# EAGLE design oled-control-panel (EAGLE 7.7.0)
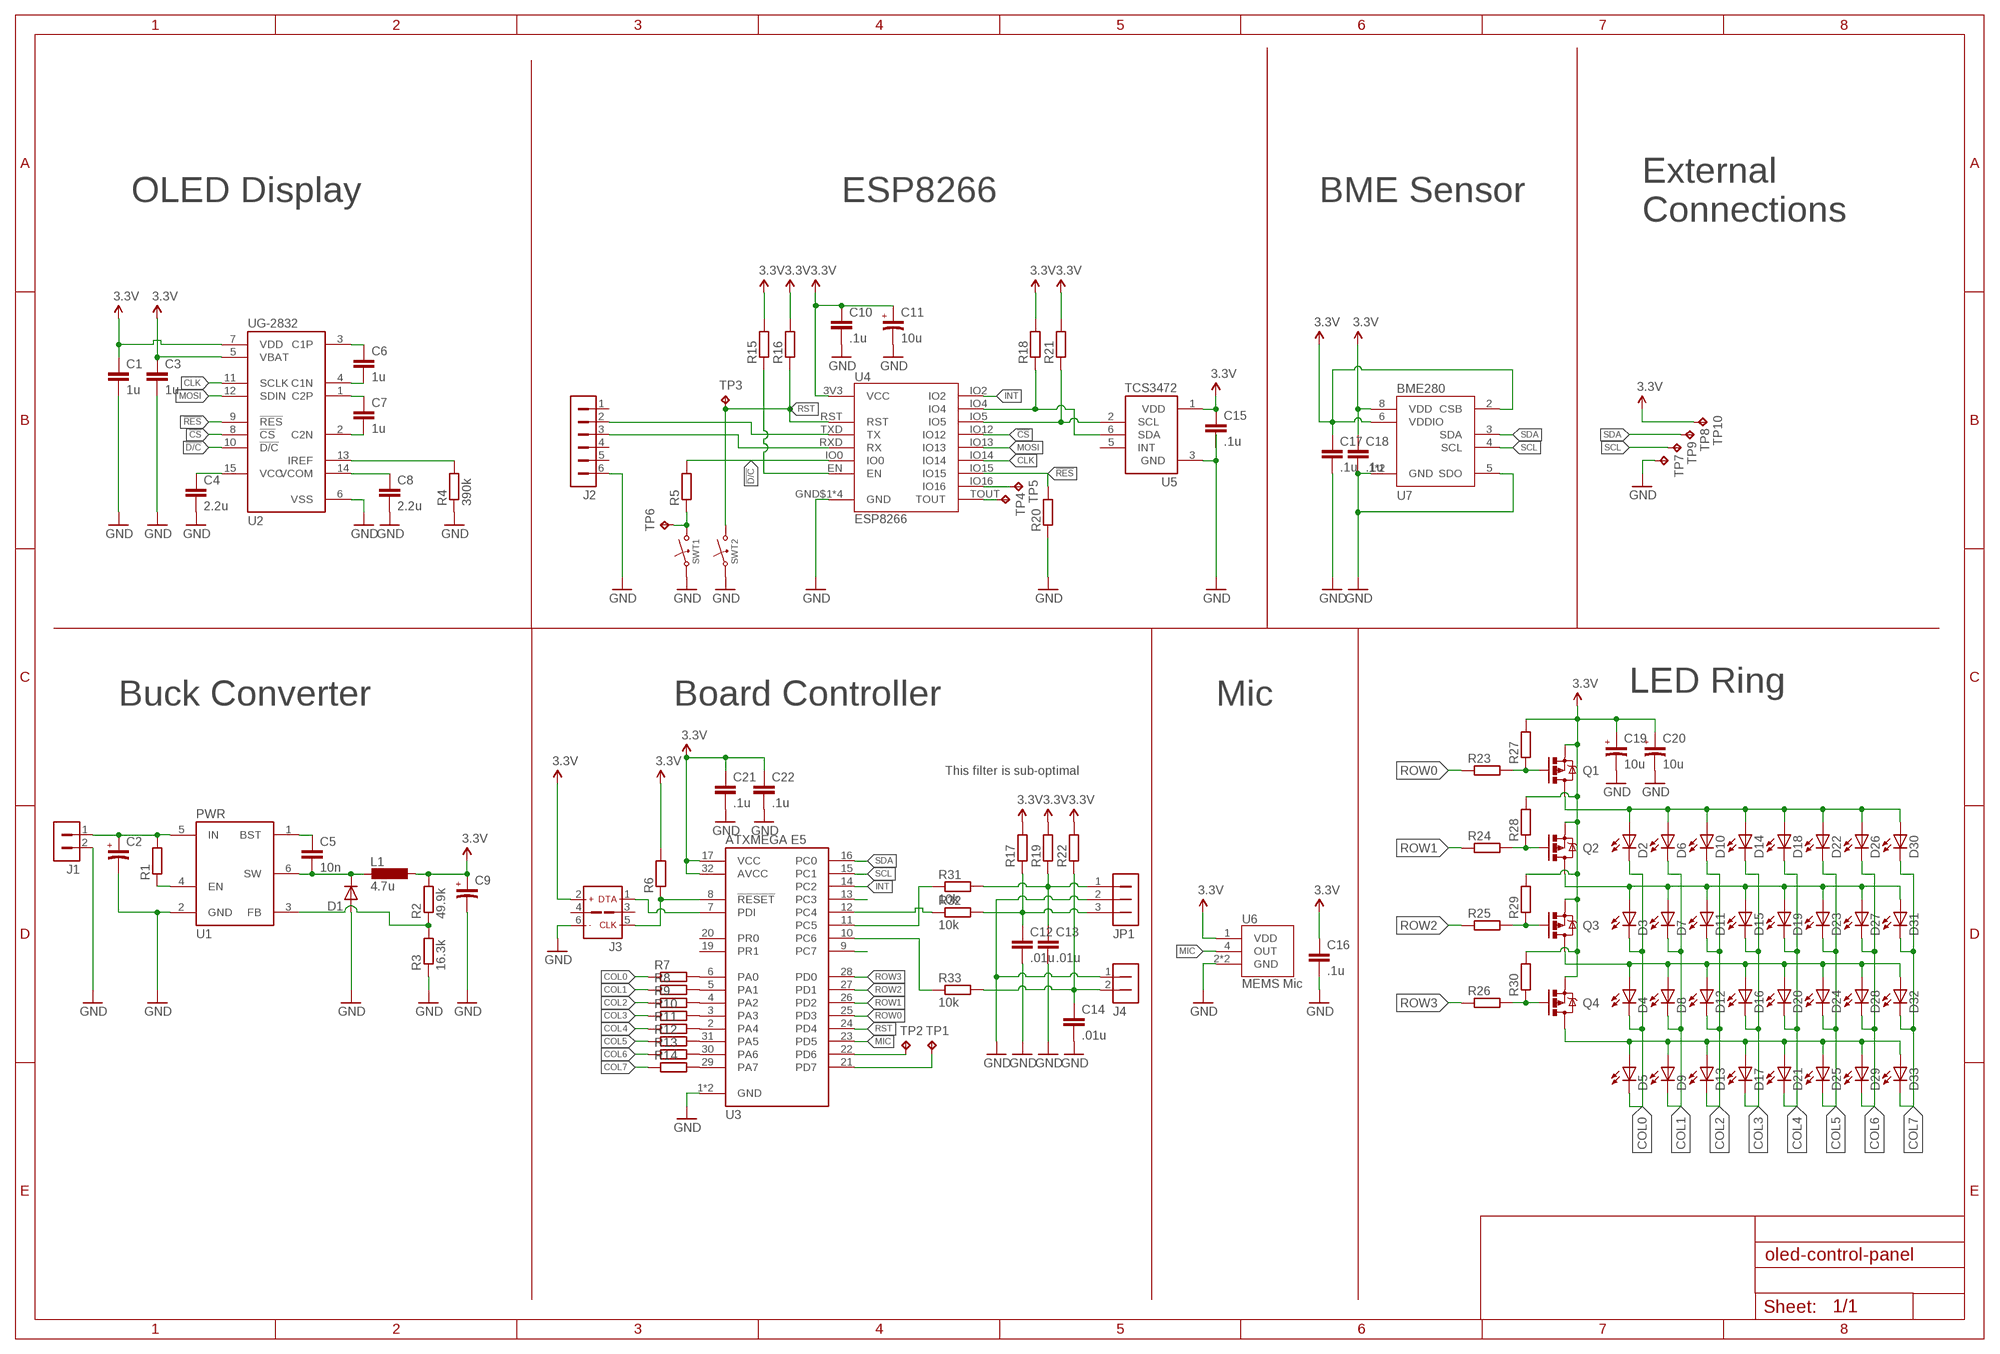
[diagram p0: schematic, sheet 1]

## Parts
C1  1u  C_0805  [0805]
C2  C_POL_1206  [1206_POL]
C3  1u  C_0805  [0805]
C4  2.2u  C_0805  [0805]
C5  10n  C_0805  [0805]
C6  1u  C_0805  [0805]
C7  1u  C_0805  [0805]
C8  2.2u  C_0805  [0805]
C9  C_POL_1206  [1206_POL]
C10  .1u  C_0603  [0603]
C11  10u  C_POL_1206  [1206_POL]
C12  .01u  C_0805  [0805]
C13  .01u  C_0805  [0805]
C14  .01u  C_0805  [0805]
C15  .1u  C_0603  [0603]
C16  .1u  C_0603  [0603]
C17  .1u  C_0603  [0603]
C18  .1u  C_0603  [0603]
C19  10u  C_POL_1206  [1206_POL]
C20  10u  C_POL_1206  [1206_POL]
C21  .1u  C_0603  [0603]
C22  .1u  C_0603  [0603]
D1  D_FM581X  [DO-214AC]
D2  LED_0805  [0805_LED]
D3  LED_0805  [0805_LED]
D4  LED_0805  [0805_LED]
D5  LED_0805  [0805_LED]
D6  LED_0805  [0805_LED]
D7  LED_0805  [0805_LED]
D8  LED_0805  [0805_LED]
D9  LED_0805  [0805_LED]
D10  LED_0805  [0805_LED]
D11  LED_0805  [0805_LED]
D12  LED_0805  [0805_LED]
D13  LED_0805  [0805_LED]
D14  LED_0805  [0805_LED]
D15  LED_0805  [0805_LED]
D16  LED_0805  [0805_LED]
D17  LED_0805  [0805_LED]
D18  LED_0805  [0805_LED]
D19  LED_0805  [0805_LED]
D20  LED_0805  [0805_LED]
D21  LED_0805  [0805_LED]
D22  LED_0805  [0805_LED]
D23  LED_0805  [0805_LED]
D24  LED_0805  [0805_LED]
D25  LED_0805  [0805_LED]
D26  LED_0805  [0805_LED]
D27  LED_0805  [0805_LED]
D28  LED_0805  [0805_LED]
D29  LED_0805  [0805_LED]
D30  LED_0805  [0805_LED]
D31  LED_0805  [0805_LED]
D32  LED_0805  [0805_LED]
D33  LED_0805  [0805_LED]
J1  1X2_MOLEX_53254  [1X2_MOLEX_53254]
J2  1X6_SMD_RIGHT  [1X6_SMD_RIGHT]
J3  PDI_SMD  [ISP_SMD]
J4  1X2_MOLEX_53254  [1X2_MOLEX_53254]
JP1  1X3_MOLEX_53254  [1X3_MOLEX_53254]
L1  4.7u  L_1210  [1210]
Q1  PMV160UP  [SOT23]
Q2  PMV160UP  [SOT23]
Q3  PMV160UP  [SOT23]
Q4  PMV160UP  [SOT23]
R1  R_0805  [0805]
R2  49.9k  R_0805  [0805]
R3  16.3k  R_0805  [0805]
R4  390k  R_0805  [0805]
R5  R_0603  [0603]
R6  R_0603  [0603]
R7  R_0603  [0603]
R8  R_0603  [0603]
R9  R_0603  [0603]
R10  R_0603  [0603]
R11  R_0603  [0603]
R12  R_0603  [0603]
R13  R_0603  [0603]
R14  R_0603  [0603]
R15  R_0603  [0603]
R16  R_0603  [0603]
R17  R_0603  [0603]
R18  R_0603  [0603]
R19  R_0603  [0603]
R20  R_0603  [0603]
R21  R_0603  [0603]
R22  R_0603  [0603]
R23  R_0603  [0603]
R24  R_0603  [0603]
R25  R_0603  [0603]
R26  R_0603  [0603]
R27  R_0603  [0603]
R28  R_0603  [0603]
R29  R_0603  [0603]
R30  R_0603  [0603]
R31  10k  R_0603  [0603]
R32  10k  R_0603  [0603]
R33  10k  R_0603  [0603]
SWT1  BUTTON_SMD_2P  [BTN_SMD_2PIN]
SWT2  BUTTON_SMD_2P  [BTN_SMD_2PIN]
TP1  TPTP15R  [TP15R]
TP2  TPTP15R  [TP15R]
TP3  TPTP15R  [TP15R]
TP4  TPTP15R  [TP15R]
TP5  TPTP15R  [TP15R]
TP6  TPTP15R  [TP15R]
TP7  TPTP15R  [TP15R]
TP8  TPTP15R  [TP15R]
TP9  TPTP15R  [TP15R]
TP10  TPTP15R  [TP15R]
U1  AP3211  [SOT23-6]
U2  UG-2832HSWEG04  [UG-2832HSWEG04]
U3  ATXMEGA_E5_TQFP  [TQFP32]
U4  ESP8266_13  [ESP13]
U5  TCS3472  [TCS3472]
U6  SPW2430HR5H_B  [SPW2430HR5H_B]
U7  BME280  [BME280]

## Nets
3.3V: C1.1 C3.1 C9.1 C10.1 C11.1 C15.1 C16.1 C17.1 C18.1 C19.1 C20.1 C21.1 C22.1 J3.2(VCC) L1.2 Q1.2(S) Q2.2(S) Q3.2(S) Q4.2(S) R2.2 R6.2 R15.2 R16.2 R17.2 R18.2 R19.2 R21.2 R22.2 R27.2 R28.2 R29.2 R30.2 TP10.TP U2.5(VBAT) U2.7(VDD) U3.17(VCC) U3.32(AVCC) U4.3V3(VCC) U5.1(VDD) U6.1(VDD) U7.2(CSB) U7.6(VDDIO) U7.8(VDD)
!CS: U2.8(!CS) U4.IO12
!D/C: R5.2 U2.10(!D/C) U4.IO0
!RES: R20.2 U2.9(!RES) U4.IO15
A: C12.1 JP1.3 R17.1 R32.2
B: R31.1 U3.11(PC5)
BTN: C14.1 J4.2 R22.1 R33.2
CLK: U2.11(SCLK) U4.IO14
COL0: D2.C D3.C D4.C D5.C R7.1
COL1: D6.C D7.C D8.C D9.C R8.1
COL2: D10.C D11.C D12.C D13.C R9.1
COL3: D14.C D15.C D16.C D17.C R10.1
COL4: D18.C D19.C D20.C D21.C R11.1
COL5: D22.C D23.C D24.C D25.C R12.1
COL6: D26.C D27.C D28.C D29.C R13.1
COL7: D30.C D31.C D32.C D33.C R14.1
GND: C1.2 C2.2 C3.2 C4.2 C8.2 C9.2 C10.2 C11.2 C12.2 C13.2 C14.2 C15.2 C16.2 C17.2 C18.2 C19.2 C20.2 C21.2 C22.2 D1.A J1.2 J2.6 J3.6(GND) J4.1 JP1.2 R3.1 R4.1 R20.1 SWT1.1 SWT2.1 TP7.TP U1.2(GND) U2.6(VSS) U3.1(GND) U3.18(GND) U4.GND$1(GND) U4.GND$2(GND) U4.GND$3(GND) U4.GND$4(GND) U5.3(GND) U6.2(GND) U6.3(GND) U7.1(GND) U7.5(SDO) U7.7(GND)
INT: U3.14(PC2) U4.IO2
MIC: U3.23(PD5) U6.4(OUT)
MOSI: U2.12(SDIN) U4.IO13
N$1: C6.1 U2.3(C1P)
N$2: C6.2 U2.4(C1N)
N$3: C7.1 U2.1(C2P)
N$4: C7.2 U2.2(C2N)
N$5: R4.2 U2.13(IREF)
N$6: C8.1 U2.14(VCOM)
N$7: C2.1 J1.1 R1.2 U1.5(IN)
N$8: C5.1 U1.1(BST)
N$9: C4.1 U2.15(VCC)
N$10: C5.2 D1.C L1.1 U1.6(SW)
N$11: R2.1 R3.2 U1.3(FB)
N$13: R1.1 U1.4(EN)
N$14: J3.5(CLK) R6.1 U3.8(!RESET)
N$15: Q1.1(G) R23.2 R27.1
N$16: Q2.1(G) R24.2 R28.1
N$17: Q3.1(G) R25.2 R29.1
N$18: Q4.1(G) R26.2 R30.1
N$19: J3.1(DATA) U3.7(PDI)
N$20: R7.2 U3.6(PA0)
N$21: R8.2 U3.5(PA1)
N$22: D3.A D7.A D11.A D15.A D19.A D23.A D27.A D31.A Q2.3(D)
N$23: D4.A D8.A D12.A D16.A D20.A D24.A D28.A D32.A Q3.3(D)
N$24: D5.A D9.A D13.A D17.A D21.A D25.A D29.A D33.A Q4.3(D)
N$25: D2.A D6.A D10.A D14.A D18.A D22.A D26.A D30.A Q1.3(D)
N$26: R9.2 U3.4(PA2)
N$27: R10.2 U3.3(PA3)
N$28: R11.2 U3.2(PA4)
N$29: R12.2 U3.31(PA5)
N$30: R13.2 U3.30(PA6)
N$31: R14.2 U3.29(PA7)
N$32: R5.1 SWT1.2 TP6.TP
N$33: TP5.TP U4.IO16
N$35: J2.2 U4.TXD(TX)
N$36: J2.3 U4.RXD(RX)
N$38: R15.1 U4.EN
N$41: R32.1 U3.12(PC4)
N$42: R33.1 U3.10(PC6)
N$43: U3.13(PC3)
N$44: C13.1 JP1.1 R19.1 R31.2
N$45: TP4.TP U4.TOUT
N$46: U3.9(PC7)
N$48: TP2.TP U3.22(PD6)
N$49: TP1.TP U3.21(PD7)
ROW0: R23.1 U3.25(PD3)
ROW1: R24.1 U3.26(PD2)
ROW2: R25.1 U3.27(PD1)
ROW3: R26.1 U3.28(PD0)
RST: R16.1 SWT2.2 TP3.TP U3.24(PD4) U4.RST
SCL: R21.1 TP9.TP U3.15(PC1) U4.IO5 U5.2(SCL) U7.4(SCL)
SDA: R18.1 TP8.TP U3.16(PC0) U4.IO4 U5.6(SDA) U7.3(SDA)
Unconnected: J2.1 J2.4 J2.5 J3.3 J3.4 U3.19(PR1) U3.20(PR0) U5.5(INT)

## Notes on the sheet
- OLED Display | ESP8266 | BME Sensor
- External
  Connections
- LED Ring
- Buck Converter | Board Controller | Mic
- This filter is sub-optimal

## Library data of the parts
C1 C3-C8 C10 C12-C18 C21 C22 = Sebastian:C
C2 C9 C11 C19 C20 = Sebastian:C_POL
D1 = Sebastian:D
D2-D33 = Sebastian:LED
J1 J4 = Sebastian:1X2
J2 = Sebastian:1X6
J3 = Sebastian:PDI
JP1 = Sebastian:1X3
L1 = Sebastian:L
Q1-Q4 = Sebastian:PMV160UP: 20 V, 1.2 A P-channel Trench MOSFET - Datasheet <http://www.nxp.com/documents/data_sheet/PMV160UP.pdf>
R1-R33 = Sebastian:R
SWT1 SWT2 = Sebastian:BUTTON
TP1-TP10 = testpad:TP: Test pad
U1 = Sebastian:AP3211
U2 = Sebastian:UG-2832HSWEG04: OLED Display Datasheet <http://www.adafruit.com/datasheets/UG-2832HSWEG04.pdf>
U3 = Sebastian:ATXMEGA_E5: ATXMEGA E5 Dataheet <http://www.atmel.com/Images/Atmel-8153-8-and-16-bit-AVR-Microcontroller-XMEGA-E-ATxmega8E5-ATxmega16E5-ATxmega32E5_Datasheet.pdf>
U4 = Sebastian:ESP8266
U5 = Sebastian:TCS3472: Color Light to Digital Converter with IR-filter Datasheet <http://www.mouser.com/ds/2/588/TCS3472_Datasheet_EN_v1-255426.pdf>
U6 = Sebastian:SPW2430HR5H_B
U7 = Sebastian:BME280

## Board
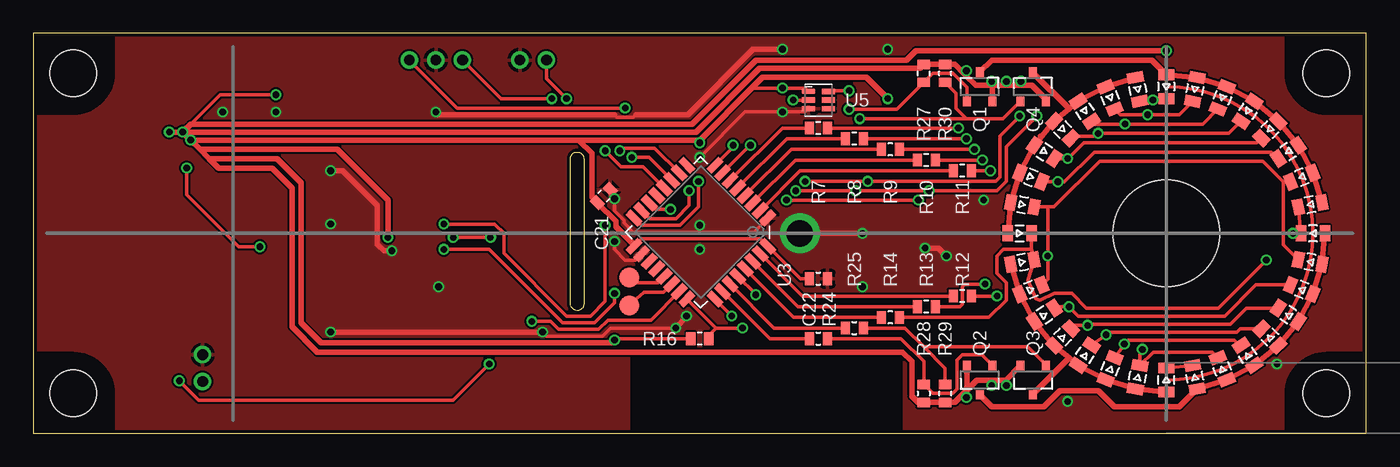
[diagram p1: board, top side]
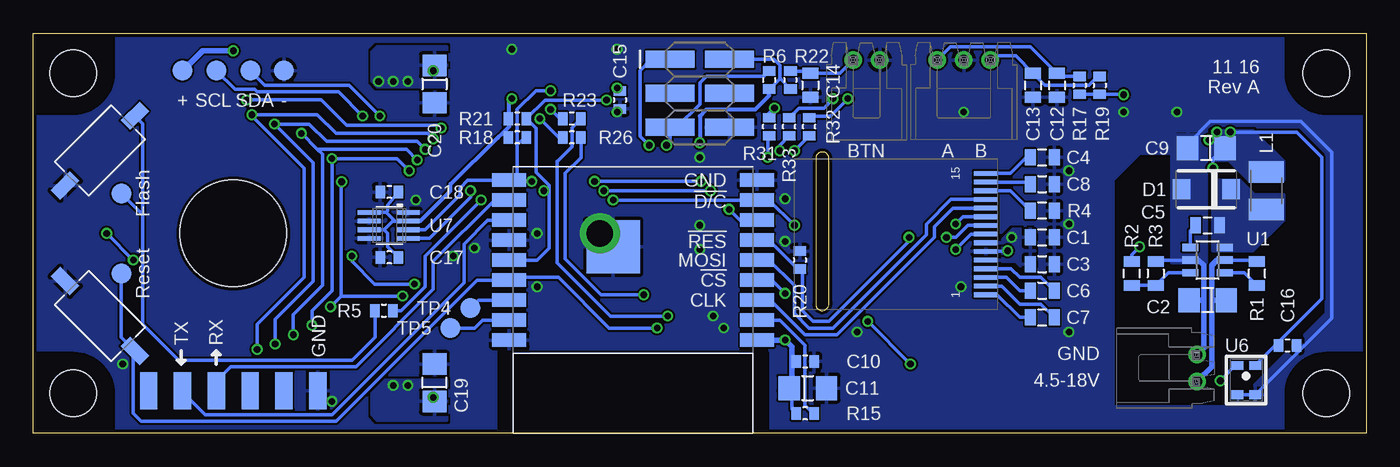
[diagram p2: board, bottom side, seen from below]

Size 100 x 30 mm. Coordinates in mm from the lower left corner, seen from the top.
Outline: 0,0 100,0 100,30 0,30 0,0
Outline: 40.3,9.8 40.3,20.6 arc-90 40.8,21.1 arc-90 41.3,20.6 41.3,9.7 arc-90 40.8,9.2 arc-90 40.3,9.8
Copper layers (1*16): Top 0.035mm / dielectric 1.5mm / Bottom 0.035mm
Design rules "SeeedStudio_2layer_DRU_no_angle_20140221": minimum track width 6mil, minimum drill 12mil, track to track 6mil, track to pad 6mil, pad to pad 6mil, via to via 6mil, smd to smd 0mil, copper to edge 10mil, drill to drill 10mil, minimum pad ring 10mil, minimum via ring 6mil, stop-mask expansion 2mil, vias tented up to drill 100mil, thermal gap 10mil
Holes 8 mm at 85,15
Holes 3.5 mm at 3,27 3,3 97,27 97,3
tKeepout: area 9.3,9.2 to 40.9,20.7; area 94,24 to 100,30; area 94,0 to 100,6; area 0,24 to 6,30; area 0,0 to 6,6
bKeepout: area 79,8.5 to 91,21.5; area 94,24 to 100,30; area 94,0 to 100,6; area 0,24 to 6,30; area 0,0 to 6,6

### Footprints (pad centres in the part's own frame; a part is rotated, then mirrored left to right if it is on the bottom)
0805 = smd 0.8 x 1.2: 1 -0.9,0; 2 0.9,0
1206_POL = smd 1.6 x 1.8: 1 -1.4,0; 2 1.4,0
0603 = smd 0.7 x 0.95: 1 -0.675,0; 2 0.675,0
DO-214AC = smd 1.32 x 1.52: A 1.85,0; C -1.85,0
0805_LED = smd 0.8 x 1.2: A -0.9,0; C 0.9,0
1X2_MOLEX_53254 = drill 0.8: 1 -1,0; 2 1,0
1X6_SMD_RIGHT = smd 1.3 x 2.8: 1 -6.35,0; 2 -3.81,0; 3 -1.27,0; 4 1.27,0; 5 3.81,0; 6 6.35,0
ISP_SMD = smd 1.27 x 3.68: 1 -2.54,-2.22; 2 -2.54,2.22; 3 0,-2.22; 4 0,2.22; 5 2.54,-2.22; 6 2.54,2.22
1X3_MOLEX_53254 = drill 0.8: 1 -2,0; 2 0,0; 3 2,0
1210 = smd 1.6 x 2.6: 1 -1.4,0; 2 1.4,0
SOT23 = smd 0.6 x 0.7: 1 -0.95,-1.1; 2 0.95,-1.1; 3 0,1.1
BTN_SMD_2PIN = smd 2 x 1: 1 -3.7,0; 2 3.7,0
TP15R = smd 1.5 x 1.5: TP 0,0
SOT23-6 = smd 0.55 x 1.2: 1 -0.95,-1.3; 2 0,-1.3; 3 0.95,-1.3; 4 0.95,1.3; 5 0,1.3; 6 -0.95,1.3
UG-2832HSWEG04 = smd 0.35 x 1.8: 1 4.55,0; 2 3.9,0; 3 3.25,0; 4 2.6,0; 5 1.95,0; 6 1.3,0; 7 0.65,0; 8 0,0; 9 -0.65,0; 10 -1.3,0; 11 -1.95,0; 12 -2.6,0; 13 -3.25,0; 14 -3.9,0; 15 -4.55,0
TQFP32 = smd 1.27 x 0.559: 1 -4.42,2.8; 2 -4.42,2; 3 -4.42,1.2; 4 -4.42,0.4; 5 -4.42,-0.4; 6 -4.42,-1.2; 7 -4.42,-2; 8 -4.42,-2.8; 17 4.166,-2.8; 18 4.166,-2; 19 4.166,-1.2; 20 4.166,-0.4; 21 4.166,0.4; 22 4.166,1.2; 23 4.166,2; 24 4.166,2.8 | smd 0.559 x 1.27: 9 -2.927,-4.293; 10 -2.127,-4.293; 11 -1.327,-4.293; 12 -0.527,-4.293; 13 0.273,-4.293; 14 1.073,-4.293; 15 1.873,-4.293; 16 2.673,-4.293; 25 2.673,4.293; 26 1.873,4.293; 27 1.073,4.293; 28 0.273,4.293; 29 -0.527,4.293; 30 -1.327,4.293; 31 -2.127,4.293; 32 -2.927,4.293
ESP13 = smd 2.54 x 1: 3V3 -9.3,3; EN -9.3,1.5; GND$1 9.3,-4.5; GND$2 9.3,3; GND$3 -9.3,-9; IO0 -9.3,-7.5; IO2 -9.3,-6; IO4 9.3,-9; IO5 9.3,-3; IO12 -9.3,-1.5; IO13 -9.3,-3; IO14 -9.3,0; IO15 -9.3,-4.5; IO16 9.3,1.5; RST 9.3,-1.5; RXD 9.3,-7.5; TOUT 9.3,0; TXD 9.3,-6 | smd 4 x 4: GND$4 1.5,-4
TCS3472 = smd 1 x 0.4: 1 -0.75,0.65; 2 -0.75,0; 3 -0.75,-0.65; 4 0.75,-0.65; 5 0.75,0; 6 0.75,0.65
SPW2430HR5H_B = smd 0.9 x 0.66: 1 0.675,1.095; 2 0.675,-1.095; 3 -0.675,-1.095; 4 -0.675,1.095
BME280 = smd 1.725 x 0.35: 1 1.4,0.975; 2 1.4,0.325; 3 1.4,-0.325; 4 1.4,-0.975; 5 -1.5,-0.975; 6 -1.5,-0.325; 7 -1.5,0.325; 8 -1.5,0.975

### Placement (x,y rotation side)
C1  24.3,14.7 0 bottom
C2  11.9,10 180 bottom
C3  24.3,12.7 0 bottom
C4  24.3,20.7 0 bottom
C5  11.9,15.6 0 bottom
C6  24.3,10.7 0 bottom
C7  24.3,8.7 0 bottom
C8  24.3,18.7 0 bottom
C9  12,21.4 180 bottom
C10  42.1,5.4 0 bottom
C11  41.9,3.4 0 bottom
C12  23.2,26.1 270 bottom
C13  25,26.1 270 bottom
C14  41.7,26.1 270 bottom
C15  56,25 270 bottom
C16  5.9,6.6 0 bottom
C17  73.3,13.2 180 bottom
C18  73.3,18.1 180 bottom
C19  69.9,3.8 90 bottom
C20  69.9,26.2 270 bottom
C21  42.8,17.8 45 top
C22  58.9,11.6 0 top
D1  12,18.3 180 bottom
D2  85,26 270 top
D3  87.15,4.21 101 top
D4  85,4 90 top
D5  82.85,25.79 281 top
D6  87.15,25.79 259 top
D7  89.21,4.84 112 top
D8  82.85,4.21 79 top
D9  80.79,25.16 292 top
D10  89.21,25.16 248 top
D11  91.11,5.85 124 top
D12  80.79,4.84 68 top
D13  78.89,24.15 304 top
D14  91.11,24.15 236 top
D15  92.78,7.22 135 top
D16  78.89,5.85 56 top
D17  77.22,22.78 315 top
D18  92.78,22.78 225 top
D19  94.15,8.89 146 top
D20  77.22,7.22 45 top
D21  75.85,21.11 326 top
D22  94.15,21.11 214 top
D23  95.16,10.79 158 top
D24  75.85,8.89 34 top
D25  74.84,19.21 338 top
D26  95.16,19.21 202 top
D27  95.79,12.85 169 top
D28  74.84,10.79 23 top
D29  74.21,17.15 349 top
D30  95.79,17.15 191 top
D31  96,15 180 top
D32  74.21,12.85 11 top
D33  74,15 0 top
J1  12.7,4.9 90 bottom
J2  85,3.2 0 bottom
J3  50,25.5 270 bottom
J4  37.5,28 180 bottom
JP1  30.2,28 180 bottom
L1  7.5,18.2 90 bottom
Q1  71,26 0 top
Q2  71,4 180 top
Q3  75,4 180 top
Q4  75,26 0 top
R1  8.2,12 90 bottom
R2  17.6,12 90 bottom
R3  15.8,12 270 bottom
R4  24.3,16.7 180 bottom
R5  73.7,9.2 0 bottom
R6  44.8,26.5 270 bottom
R7  58.9,22.9 180 top
R8  61.6,22.1 180 top
R9  64.3,21.3 180 top
R10  67,20.5 180 top
R11  69.7,19.7 180 top
R12  69.7,10.3 180 top
R13  67,9.5 180 top
R14  64.3,8.7 180 top
R15  42.1,1.5 180 bottom
R16  50,7.1 180 top
R17  21.5,26.1 270 bottom
R18  63.7,22.2 180 bottom
R19  20,26.1 270 bottom
R20  42.5,13 270 bottom
R21  63.7,23.6 180 bottom
R22  43.2,26.5 270 bottom
R23  59.6,23.6 180 bottom
R24  58.9,7.1 0 top
R25  61.6,7.9 0 top
R26  59.6,22.2 180 bottom
R27  66.8,27 90 top
R28  66.8,3 270 top
R29  68.4,3 270 top
R30  68.4,27 90 top
R31  44.8,23 90 bottom
R32  41.8,23 90 bottom
R33  43.3,23 90 bottom
SWT1  95,21.2 45 bottom
SWT2  95,8.8 315 bottom
TP1  44.7,11.7 0 top
TP2  44.7,9.6 0 top
TP3  93.4,12 0 bottom
TP4  67.2,9.4 0 bottom
TP5  68.7,7.9 0 bottom
TP6  93.4,18 0 bottom
TP7  81.19,27.2 0 bottom
TP8  83.73,27.2 0 bottom
TP9  86.27,27.2 0 bottom
TP10  88.81,27.2 0 bottom
U1  11.9,13 270 bottom
U2  28.54,14.95 270 bottom
U3  50,15 225 top
U4  55,10 180 bottom
U5  58.9,25 0 top
U6  9,4 0 bottom
U7  73.3,15.6 0 bottom

### Tracks (layer width: path | path; a pad name or v marks a point on that pad's centre or on a via)
3.3V  (via drill 0.5)
  Top 0.254: v17,14 15.4,14 11.5,17.9 v11.5,19.9 | R16.2 43.7,7.1 v43.6,7 | U5.1 57.9,25.9 v56.2,25.9 54.1,25.9 54,26 | 11.8,23.2 14,25.4 v18.2,25.4 | C22.1 57.54,11.6 U3.32 54.54,14.6 45.64,14.6 U3.17 | C21.1 42.4,17.3 42.3,17.3
  Top 0.406: v10.2,22.6 v11.2,22.6 | v26.6,14.7 26.6,17.5 22.8,21.3 12.5,21.3 | v11.2,22.6 49.7,22.6 54.48,27.38 66.5,27.38 R27.2 R30.2 69.12,27.68 69.9,26.9 | 12.5,21.3 v11.8,22 | U3.17 45.08,14.12 43.7,15.5 43.7,15.9 42.3,17.3 41.9,17.7 41.9,21 40.9,22 | 40.9,22 v11.8,22 | v11.8,22 v11.2,22.6 | 13.2,20.6 13.9,19.9 17.9,19.9 19.4,18.4 19.4,8 21.3,6.1 65.2,6.1 65.9,5.4 65.9,2.8 66.4,2.3 66.78,2.3 R28.2 R29.2 69.12,2.33 69.8,3 | 13.2,20.6 12.5,21.3 | v43.6,7 43.4,6.8 21.6,6.8 20.1,8.3 20.1,18.8 18.3,20.6 13.2,20.6 | Q4.2 75.95,25.05 74.9,26.1 74,26.1 | 74,26.1 73,26.1 | 73,26.1 72,26.1 | 72,26.1 70.7,26.1 69.9,26.9 | v70,27.2 70,27 69.9,26.9 | 72,26.1 71.9,26.2 v71.9,26.4 71.95,26.35 Q1.2 | v73,26.4 73,26.1 | v74.1,26.4 74.1,26.2 74,26.1 | 69.8,3 70.05,3.25 | 70.05,3.25 70.8,4 72,4 | 72,4 72.95,4 | 72.95,4 Q3.2 | Q2.2 70.05,3.25 | v71.9,3.6 71.9,3.9 72,4 | v73,3.6 73,3.95 72.95,4 | v70,2.7 70,2.8 69.8,3 | v50,21.8 50,22 | 50,22 40.9,22 | 50,22 54,26 54.7,26.7 62.5,26.7 v64.1,25.1 | v85,28.7 66.2,28.7 65.5,28 54.2,28 49.4,23.2 11.8,23.2 v11.2,22.6
  Bottom 0.254: R2.2 17.6,13.4 v17,14 | v11.5,19.9 11.5,20.6 C9.1 | 48.96,28.04 J3.2 44.44,28.04 44,27.6 44,26.62 | 44.2,7 44.17,6.97 | R6.2 44.77,25.82 44,26.6 44,26.62 | C18.1 73.4,17.1 73.4,16.7 73.53,16.57 | 73.53,16.57 U7.8 | 73.67,15.28 73.4,15 73.4,14 72.6,13.2 C17.1 | 73.67,15.28 U7.6 | 73.53,16.57 72.88,15.93 | 72.88,15.93 U7.2 | 73.67,15.28 73.03,15.93 72.88,15.93 | R17.2 R19.2 18.23,25.43 v18.2,25.4 | R18.2 64.39,22.2 64.75,22.56 | R21.2 64.38,23.57 64.3,23.5 | R22.2 44,26.62 | v10.2,22.6 5.2,22.6 3.33,20.73 3.33,10.1 6.82,6.6 | 6.82,6.6 U6.1 | v56.2,25.9 C15.1 | C16.1 6.82,6.6 | 43.1,3 43.1,1.82 R15.2
  Bottom 0.305: v50,21.8 50,23.8 49.5,24.3 45.83,24.3 44.8,25.32 R6.2 | U7.2 70.97,15.93 68.7,18.2 68.7,18.7 65.16,22.16 64.75,22.56 64.3,23 64.3,23.5 64.3,24.9 v64.1,25.1
  Bottom 0.406: U4.3V3 44.2,7 v43.6,7 43.1,6.5 43.1,5 | 43.1,3 43.9,3.2 C11.1 43.1,3.6 43.1,5 | TP10.TP 87.31,28.7 v85,28.7 | C10.1 42.77,5.33 43.1,5
  pour Bottom (no thermals): 6.2,19 8.8,19 10.3,20.5 11.5,20.5 11.5,22.7 8.5,22.7 6.2,20.4
  pour Bottom: 69,1 74.2,1 74.6,1.4 74.6,3.6 74.2,4 69,4
  pour Bottom: 69,26 74.2,26 74.6,26.4 74.6,28.6 74.2,29 69,29
  pour Bottom: 24.9,15.3 26.5,15.3 27.4,14.4 28,14.4 28,12.9 26.3,12.9 25.6,12.2 24.9,12.2
!CS  (via drill 0.5)
  Top 0.254: v43.6,10.5 43.6,9.8 42.1,8.3 39.7,8.3 34.2,13.8 v30.8,13.8
  Bottom 0.254: U4.IO12 44.6,11.5 v43.6,10.5 | v30.8,13.8 29.65,14.95 U2.8
!D/C  (via drill 0.5)
  Top 0.254: v56.5,17.5 v66.4,17.5 | v42.9,15.6 42.9,9.9 41.8,8.8 40,8.8 35.3,13.5 35.3,15 34.6,15.7 v30.8,15.7
  Bottom 0.254: v56.5,17.5 U4.IO0 44.8,17.5 v42.9,15.6 | v66.4,17.5 70.6,13.3 70.6,11 72.4,9.2 R5.2 | U2.10 30.25,16.25 v30.8,15.7
!RES  (via drill 0.5)
  Top 0.254: v31.5,14.7 v34.3,14.7
  Bottom 0.254: U2.9 29.9,15.6 30.8,14.7 v31.5,14.7 | U4.IO15 44.8,14.5 42.4,12.1 | v34.3,14.7 34.3,14.4 40.3,8.4 41.5,8.4 42.3,9.2 42.3,12 42.4,12.1 | R20.2 42.4,12.1
A  (via drill 0.5)
  Top 0.254: v38.9,25.1 35.1,25.1 JP1.3
  Bottom 0.254: JP1.3 31.2,29 25.2,29 C12.1 22.98,26.77 R17.1 | v38.9,25.1 40.2,23.8 41.67,23.8 R32.2
B  (via drill 0.5)
  Top 0.254: U3.11 46.18,20.7 v44.9,20.7
  Bottom 0.254: v44.9,20.7 44.9,22.1 44.8,22.2 R31.1
BTN  (via drill 0.5)
  Top 0.254: v40,25.1 38.5,26.6 J4.2
  Bottom 0.254: J4.2 39.5,27 C14.1 41.88,27.18 R22.1 | v40,25.1 40.7,24.4 42.58,24.4 R33.2
CLK
  Bottom 0.254: U4.IO14 44.7,10 42.1,7.4 39.7,7.4 32.4,14.7 32.4,15.5 31,16.9 U2.11
COL0  (via drill 0.5)
  Top 0.254: D5.C v84,25 | v84,25 D2.C | D2.C 85,26 arc-90 96,15 arc-90 85,4 D4.C D3.C | v84,25 84.1,25.1 D2.C | v69.4,22.9 R7.1
  Bottom 0.254: v84,25 78.4,25 76.5,23.1 69.6,23.1 v69.4,22.9
COL1  (via drill 0.5)
  Top 0.254: D7.C 88.45,6.1 84.03,6.1 D8.C 83.02,6.12 v83.2,6.3 | D6.C 85.97,23.9 v83.6,23.9 81.55,23.9 D9.C | v70,22.1 R8.1
  Bottom 0.254: v83.2,6.3 83.2,8.2 79.7,11.7 79.7,19.9 83.7,23.9 v83.6,23.9 78.7,23.9 77.3,22.5 70.4,22.5 v70,22.1
COL2  (via drill 0.5)
  Top 0.254: D12.C v81.85,6.7 82.15,7 90.1,7 90.4,6.7 D11.C | D10.C 87.75,23.2 v81.9,23.2 79.6,23.2 D13.C | v70.6,21.3 R9.1
  Bottom 0.254: v81.85,6.7 81.85,8.55 79,11.4 79,20.3 v81.9,23.2 79.3,23.2 78,21.9 71.2,21.9 v70.6,21.3
COL3  (via drill 0.5)
  Top 0.254: D16.C v80.5,7.4 80.7,7.6 90.3,7.6 90.56,7.86 D15.C | D14.C 89.7,22.5 v79.88,22.5 79.68,22.3 78.01,22.3 D17.C | v71.2,20.5 R10.1
  Bottom 0.254: v79.88,22.5 78.69,21.31 | 78.69,21.31 78.3,20.92 78.3,11.1 80.5,8.9 v80.5,7.4 | v71.2,20.5 72.01,21.31 78.69,21.31
COL4  (via drill 0.5)
  Top 0.254: D20.C 78.1,8.1 v79.1,8.1 79.2,8.2 89.8,8.2 90.99,9.39 D19.C | D21.C v77.61,20.61 78.8,21.8 91.8,21.8 D18.C | v71.8,19.7 R11.1
  Bottom 0.254: v79.1,8.1 79.1,9.2 77.6,10.7 v77.6,20.6 v77.61,20.61 72.71,20.61 v71.8,19.7
COL5  (via drill 0.5)
  Top 0.254: D24.C 76.7,9.5 v77.7,9.5 78.4,8.8 89.4,8.8 91.73,11.13 D23.C | D22.C 92.9,21.1 79.6,21.1 77.37,18.87 v76.87,18.87 D25.C | v72.3,10.3 R12.1
  Bottom 0.254: 76.9,10.3 76.9,18.8 v76.87,18.87 | v72.3,10.3 76.9,10.3 | 76.9,10.3 v77.7,9.5
COL6  (via drill 0.5)
  Top 0.254: 76.1,16.98 v76.1,13.3 76.1,11.57 D28.C | D29.C 76.1,16.98 | 76.1,16.98 76.58,16.98 80,20.4 92.25,20.4 93.77,18.87 | D26.C 93.77,18.87 | 93.77,18.87 93.77,14.15 D27.C | R13.1 69.5,9.5 69.7,9.7 69.7,11 69.9,11.2 v71.4,11.2
  Bottom 0.254: v71.4,11.2 74.4,11.2 76.1,12.9 v76.1,13.3
COL7  (via drill 0.5)
  Top 0.254: 74.9,13.8 D32.C 74.6,11.5 75.2,10.1 75.5,10 76.6,10.5 77.9,10.5 79,9.4 88.9,9.4 v92.5,13 | 74.9,13.8 D33.C | D30.C D31.C v94.5,15 | 74.9,13.8 72.8,13.8 72.3,13.3 72.3,12 73,11.3 73,10 71.7,8.7 R14.1
  Bottom 0.254: v92.5,13 v94.5,15
GND  (via drill 0.5, 2)
  Top 0.254: v50,20.7 53.4,24.1 v56.2,24.1 57.9,24.1 U5.3 | v43.6,14.4 43.6,13.8 44.4,13 45.17,13 U3.18 | v48.2,7.9 43.3,7.9 42.7,7.3 38.5,7.3 v38.2,7.6 | v43.6,17.6 43.6,16.7 44.3,16 44.3,15.8 45,15.1 54.06,15.1 U3.1 | 45.2,23.9 45,23.7 43.8,23.7 43.6,23.9
  Top 0.406: v22.3,19.7 23.2,19.7 25.8,17.1 25.8,14.2 26.3,13.7 v26.9,13.7 | v22.3,7.6 v38.2,7.6 | U3.1 55.1,16.11 | v62.2,15 v57.5,15 | v48.2,7.9 v49,8.8 | v56.2,28.8 54,28.8 49.1,23.9 45.2,23.9 | 43.6,23.9 30.4,23.9 v30.2,24.1 | v68.5,13.3 67.9,13.9 v66.9,13.9
  Bottom 0.254: U1.2 15.7,13 R3.1 | U2.6 26.95,13.65 v26.9,13.7 | U6.3 U6.2 5.22,6 | 5.22,6 C16.2 | C9.2 13.4,21.7 11.7,23.4 4.9,23.4 2.6,21.1 2.6,8.63 5.22,6
  Bottom 0.406: 12.2,10 12.2,6.4 J1.2 | 12.2,10 12.2,12.6 12.6,13 U1.2 | C2.2 12.2,10
  other vias: 30.4,11 22.3,15.7 64.1,28.8 71.3,17.5 62.2,11 18.2,24.1 14.2,24.1 50,15.6 50,13.8 77.6,2.4 93.3,5.2
  pour Bottom (rank 3, no thermals): 12,12.8 12,22.4 14.5,22.4 14.6,22.3 14.6,12.8
  pour Bottom (rank 6): 12,30 12,21 17,21 19,19 19,0 100,0 100,30
  pour Bottom (rank 6): 14,30 0,30 0,0 20,0 20,2 10,2 3,9 3,21 5,23 14,23
  pour Top: 0,30 101,30 101,0 0,0
INT  (via drill 0.5)
  Top 0.254: v47.8,16.8 46.68,16.8 U3.14
  Bottom 0.254: U4.IO2 47,16 v47.8,16.8
MIC  (via drill 0.5)
  Top 0.254: U3.23 46.33,8.5 43.1,8.5 42.4,7.8 39.4,7.8 38.8,8.4 v37.4,8.4 | v10.95,3.95 12.4,2.5 31.5,2.5 v34.2,5.2
  Bottom 0.254: v37.4,8.4 v34.2,5.2 | v10.95,3.95 9.8,5.09 U6.4
MOSI
  Bottom 0.254: U4.IO13 44.8,13 42.9,11.1 42.9,9 41.8,7.9 40,7.9 33,14.9 33,15.7 31.15,17.55 U2.12
N$1
  Bottom 0.254: U2.3 27,11.7 26,10.7 C6.1
N$2
  Bottom 0.254: U2.4 26.65,12.35 26,11.7 24.4,11.7 C6.2
N$3
  Bottom 0.254: C7.1 26,8.7 27.7,10.4 U2.1
N$4
  Bottom 0.254: U2.2 27.35,11.05 26,9.7 24.4,9.7 C7.2
N$5
  Bottom 0.254: U2.13 26.7,18.2 R4.2
N$6
  Bottom 0.254: U2.14 25.35,18.85 C8.1
N$7
  Bottom 0.254: U1.5 8.3,13 R1.2
  Bottom 0.406: 11.6,10 11.6,5 J1.1 | 11.6,10 11.6,12.6 11.2,13 U1.5 | C2.1 11.6,10
N$8
  Bottom 0.254: U1.1 13.2,15.2 C5.1
N$9
  Bottom 0.254: U2.15 26.7,19.5 25.5,20.7 C4.1
N$10
  pour Bottom (rank 2, no thermals): 11.5,13.7 11.5,18.7 11.2,19 9.5,19 8.4,17.9 6.2,17.9 6.2,16 8.5,13.7
N$11
  Bottom 0.254: U1.3 14.85,12.05 R3.2 R2.1
N$12
  cutout Bottom: 45,6 65,6 65,0 45,0
  cutout Top: 45,6 65,6 65,0 45,0
N$13
  Bottom 0.254: U1.4 9.15,12.05 R1.1
N$14  (via drill 0.5)
  Top 0.254: U3.8 52.5,21.46 v52.5,21.6
  Bottom 0.254: v52.5,21.6 52.22,21.92 J3.5 51.74,22.96 50,24.7 50,26.3 49.5,26.8 45.17,26.8 R6.1
N$15  (via drill 0.5)
  Top 0.254: v61.2,24.3 64.78,24.3 R27.1 67.47,27 69,27 70.05,25.95 Q1.1
  Bottom 0.254: R23.2 60.5,23.6 v61.2,24.3
N$16
  Top 0.254: R24.2 65.1,7.1 66.8,5.4 R28.1 66.83,3.67 67.5,3 69,3 69.3,3.3 69.3,5.5 69.7,5.9 71.15,5.9 Q2.1
N$17
  Top 0.254: R25.2 65.4,7.9 66.8,6.5 | 66.8,6.5 68.4,4.9 R29.1 | Q3.1 75.95,5.15 74.6,6.5 66.8,6.5
N$18  (via drill 0.5)
  Top 0.254: Q4.1 72.75,23.6 70,23.6 | 70,23.6 v62,23.6 | R30.1 69.2,25.52 69.2,24.4 70,23.6
  Bottom 0.254: R26.2 60.6,22.2 v62,23.6
N$19  (via drill 0.5)
  Top 0.254: U3.7 53.8,21.63 v53.8,21.6
  Bottom 0.254: J3.1 53.66,28.04 54.5,27.2 54.5,22.3 v53.8,21.6
N$20
  Top 0.254: R7.2 56.2,22.9 U3.6
N$21
  Top 0.254: R8.2 56.53,22.1 U3.5
N$22
  Top 0.406: D31.A D27.A D23.A D19.A D15.A D11.A D7.A D3.A 86,2 81.1,2 79.9,3.2 77,3.2 75.8,2 71.9,2 Q2.3
N$23
  Top 0.406: D32.A D28.A D24.A D20.A 77.72,5.65 | 77.72,5.65 D16.A | D16.A D12.A D8.A D4.A | 78.1,5.1 D16.A | Q3.3 75,2.94 77.72,5.65
N$24
  Top 0.406: D33.A D29.A D25.A D21.A 75.65,22.28 | 75.65,22.28 D17.A 77.72,24.35 | 77.72,24.35 D13.A D9.A D5.A | 75.57,22.28 75.65,22.28 | Q4.3 75,27.06 77.72,24.35
N$25
  Top 0.406: D30.A D26.A D22.A D18.A D14.A D10.A D6.A D2.A 83.9,28 71.9,28 Q1.3
N$26
  Top 0.254: R9.2 56.87,21.3 U3.4
N$27
  Top 0.254: R10.2 57.2,20.5 U3.3
N$28
  Top 0.254: R11.2 57.53,19.7 U3.2
N$29
  Top 0.254: R12.2 57.71,10.3 U3.31
N$30
  Top 0.254: R13.2 57.38,9.5 U3.30
N$31
  Top 0.254: R14.2 57.05,8.7 U3.29
N$32
  Bottom 0.254: R5.1 74.38,7.22 76.1,5.5 89.1,5.5 91.8,8.2 91.8,16 91.8,16.4 | 91.8,16.4 TP6.TP | SWT1.2 91.8,23.23 91.8,16.4
N$33
  Bottom 0.254: U4.IO16 66.3,8.5 66.9,7.9 TP5.TP
N$34
  cutout Bottom: 94,0 94,3 arc-90 97,6 100,6 100,0
  cutout Bottom: 94,0 94,3 arc-90 97,6 100,6 100,0
  cutout Top: 94,0 94,3 arc-90 97,6 100,6 100,0
N$35
  Bottom 0.254: U4.TXD 65.9,16 67.7,14.2 67.7,11.3 77.6,1.4 87.11,1.4 88.81,3.1 J2.2
N$36
  Bottom 0.254: U4.RXD 65.4,17.5 70,12.9 70,10.8 75.8,5 85.2,5 86.27,3.93 J2.3
N$37
  cutout Bottom: 94,30 94,27 arc90 97,24 100,24 100,30
  cutout Top: 94,30 94,27 arc90 97,24 100,24 100,30
N$38
  Bottom 0.254: U4.EN 44,8.5 42.1,6.6 42.1,2.1 41.52,1.52 R15.1
N$39
  cutout Bottom: 0,0 0,6 3,6 arc-90 6,3 6,0
  cutout Top: 0,0 0,6 3,6 arc-90 6,3 6,0
N$40
  cutout Bottom: 0,30 0,24 3,24 arc90 6,27 6,30
  cutout Top: 0,30 0,24 3,24 arc90 6,27 6,30
N$41  (via drill 0.5)
  Top 0.254: U3.12 45.74,20 44.1,20 v42.9,21.2
  Bottom 0.254: v42.9,21.2 41.8,22.3 R32.1
N$42  (via drill 0.5)
  Top 0.254: U3.10 46.61,21.4 44.2,21.4 v44,21.2
  Bottom 0.254: R33.1 44,21.62 v44,21.2
N$44  (via drill 0.5)
  Top 0.254: JP1.1 31.8,24.4 v44.4,24.4
  Bottom 0.254: JP1.1 27.9,28.3 26.3,28.3 C13.1 24.1,26.1 20.8,26.1 20.12,26.77 R19.1 | v44.4,24.4 44.8,24 R31.2
N$45
  Bottom 0.254: U4.TOUT 66.6,10 TP4.TP
N$48
  Top 0.254: U3.22 47.3,10.6 45.8,10.6 TP2.TP
N$49
  Top 0.254: U3.21 46.87,11.3 44.9,11.3 TP1.TP
ROW0  (via drill 0.5)
  Top 0.254: U3.25 51.15,10.05 v52.4,8.8
  Bottom 0.254: v52.4,8.8 56.7,8.8 60.7,12.8 60.7,20.43 60.67,20.43 59.6,21.5 59.6,22.93 R23.1
ROW1
  Top 0.254: U3.26 55.25,7.1 R24.1
ROW2
  Top 0.254: U3.27 55.58,7.9 R25.1
ROW3  (via drill 0.5)
  Top 0.254: U3.28 54.2,10.41 v54.2,10.4
  Bottom 0.254: v54.2,10.4 57.4,10.4 60.1,13.1 60.1,19.5 58.92,20.68 R26.1
RST  (via drill 0.5)
  Top 0.254: U3.24 51.21,7.9 | 51.21,7.9 v53.2,7.9 | R16.1 50.67,7.37 51.21,7.9
  Bottom 0.254: v53.2,7.9 56.8,7.9 60.6,11.7 63.1,11.7 63.3,11.5 U4.RST 66.7,11.5 77.3,0.9 91.9,0.9 92.5,1.5 92.5,6.27 SWT2.2 93.4,7.2 TP3.TP
SCL  (via drill 0.5)
  Top 0.254: v57.2,18.2 v61.7,18.2 v67.2,18.2 72.3,18.2 73,18.9 73,21.5 v75.3,23.8 | v57,25 U5.2 | U3.15 46.25,16.1 48.2,16.1 49.2,17.1 v49.2,18.2
  Bottom 0.254: v57.2,18.2 v49.2,18.2 | U4.IO5 62.2,13 61.3,13.9 61.3,18.2 | v67.2,18.2 67.2,17.7 70.28,14.62 U7.4 | v57,25 61.62,25 R21.1 63,23.6 62.3,22.9 62.3,19.6 61.3,18.6 61.3,18.2 | v75.3,23.8 77.1,25.6 83.2,25.6 83.4,25.8 84.87,25.8 TP9.TP | 61.3,18.2 v61.7,18.2
SDA  (via drill 0.5)
  Top 0.254: v57.9,18.9 v62.6,18.9 72.2,18.9 72.5,19.2 72.5,22.3 v74,23.8 | U3.16 45.62,15.6 48.5,15.6 49.9,17 v49.9,18.9 | U5.6 59.7,25.7 v61.2,25.7
  Bottom 0.254: v62.6,18.9 63.7,18.9 | 63.7,18.9 64.2,18.9 U4.IO4 | v57.9,18.9 v49.9,18.9 | U4.IO4 64,19 | U4.IO4 67.4,19 68,18.4 68,17.9 70.62,15.28 U7.3 | v61.2,25.7 62.3,25.7 63.7,24.3 63.7,21.7 | 63.7,21.7 63.7,18.9 | R18.1 63.7,21.7 | v74,23.8 76.3,26.1 82.63,26.1 TP8.TP

### Text on the board
bPlace: 11 16 | Rev A | - | SDA | SCL | + | B | A | BTN | GND | Flash | !D/C | !RES | MOSI | !CS | Reset | CLK | RX | TX | GND | GND | 4.5-18V